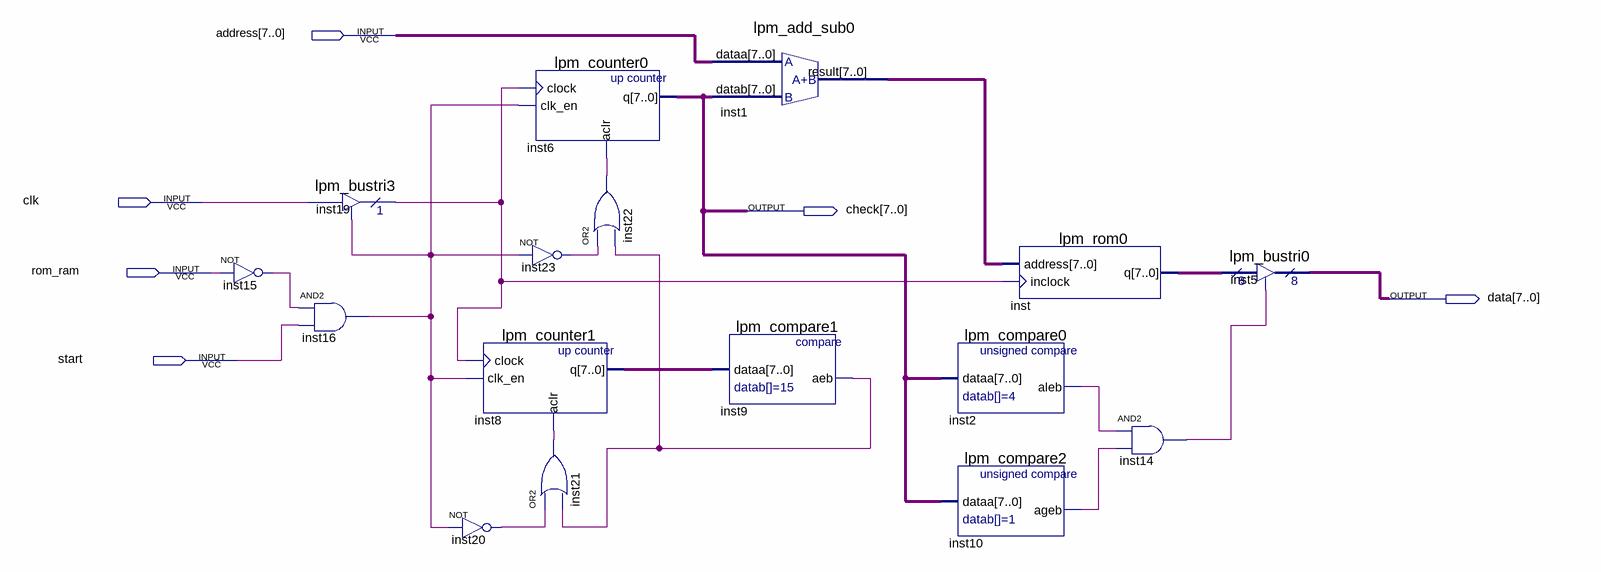
[diagram p0: schematic sheet]
// Quartus schematic ROM_block.bdf as structural Verilog: 16 symbols, 6 pins
module ROM_block (
  input  [7:0] address,
  input  clk,
  input  rom_ram,
  input  start,
  output [7:0] check,
  output [7:0] data
);

  wire inst2_aleb, inst9_aeb, inst10_ageb, inst14_out, inst15_out, inst16_out, inst19_tridata, inst20_out,
       inst21_out, inst22_out, inst23_out;
  wire [7:0] inst1_result, inst8_q, inst_q;

  not inst15 (inst15_out, rom_ram);
  lpm_bustri3 inst19 (.enabledt(inst16_out), .data(clk), .tridata(inst19_tridata));
  and inst16 (inst16_out, inst15_out, start);
  not inst20 (inst20_out, inst16_out);
  lpm_counter0 inst6 (.clock(inst19_tridata), .clk_en(inst16_out), .aclr(inst22_out), .q(check));
  not inst23 (inst23_out, inst16_out);
  lpm_counter1 inst8 (.clock(inst19_tridata), .clk_en(inst16_out), .aclr(inst21_out), .q(inst8_q));
  or inst21 (inst21_out, inst20_out, inst9_aeb);
  or inst22 (inst22_out, inst23_out, inst9_aeb);
  lpm_add_sub0 inst1 (.dataa(address), .datab(check), .result(inst1_result));
  lpm_compare1 inst9 (.dataa(inst8_q), .aeb(inst9_aeb));
  lpm_compare0 inst2 (.dataa(check), .aleb(inst2_aleb));
  lpm_compare2 inst10 (.dataa(check), .ageb(inst10_ageb));
  lpm_rom0 inst (.address(inst1_result), .inclock(inst19_tridata), .q(inst_q));
  and inst14 (inst14_out, inst2_aleb, inst10_ageb);
  lpm_bustri0 inst5 (.enabledt(inst14_out), .data(inst_q), .tridata(data));
endmodule
